# EAGLE design BB-PCF (EAGLE 6.3)
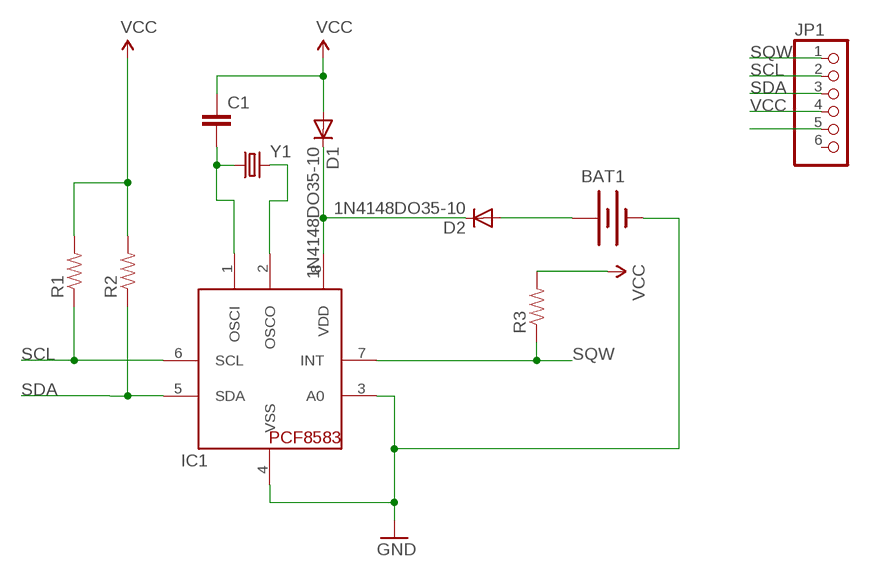
[diagram p0: schematic, sheet 1]

## Parts
BAT1  BATTERY20PTH  [BATTCOM_20MM_PTH]
C1  CAPPTH  [CAP-PTH-SMALL]
D1  1N4148DO35-10  [DO35-10]
D2  1N4148DO35-10  [DO35-10]
IC1  PCF8583  [DIL08]
JP1  PINHD-1X6  [1X06]
R1  RESISTORPTH-1/4W  [AXIAL-0.4]
R2  RESISTORPTH-1/4W  [AXIAL-0.4]
R3  RESISTORPTH-1/4W  [AXIAL-0.4]
Y1  CRYSTALTC26H_EZ  [TC26HEZ]

## Nets
GND: BAT1.2(-) IC1.3(A0) IC1.4(VSS) JP1.5
N$1: D1.C D2.C IC1.8(VDD)
N$2: BAT1.1(+) D2.A
N$5: C1.2 IC1.1(OSCI) Y1.1
N$6: IC1.2(OSCO) Y1.2
SCL: IC1.6(SCL) JP1.2 R1.P$1
SDA: IC1.5(SDA) JP1.3 R2.P$1
SQW: IC1.7(INT) JP1.1 R3.P$1
VCC: C1.1 D1.A JP1.4 R1.P$2 R2.P$2 R3.P$2
Unconnected: JP1.6

## Library data of the parts
BAT1 = SparkFun-Electromechanical:BATTERY: Battery Holders Various common sizes : AA, AAA, 20mm coin cell and 12mm coin cell.
C1 = SparkFun-Capacitors:CAP: Capacitor Standard 0603 ceramic capacitor, and 0.1" leaded capacitor.
D1 D2 = diode:1N4148: DIODE high speed (Philips)
IC1 = RTC:PCF8583: PCF8583 Real time clock (RTC) with battery backup ability. Talk to it via i2c
JP1 = adafruit:PINHD-1X6: PIN HEADER
R1-R3 = SparkFun-Resistors:RESISTOR: Resistor Basic schematic elements and footprints for 0603, 1206, and PTH resistors.
Y1 = SparkFun-FreqCtrl:CRYSTAL: Various standard crystals. Proven footprints. Spark Fun Electronics SKU : COM-00534

## Board
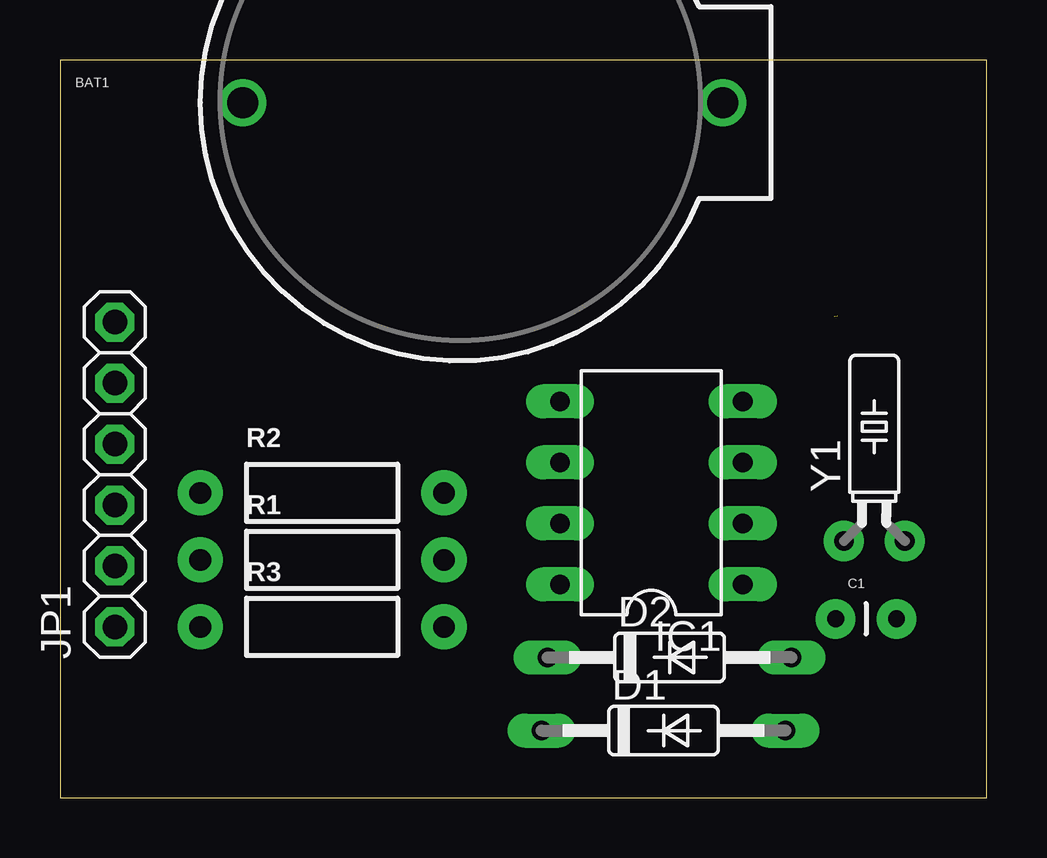
[diagram p1: board, top side]
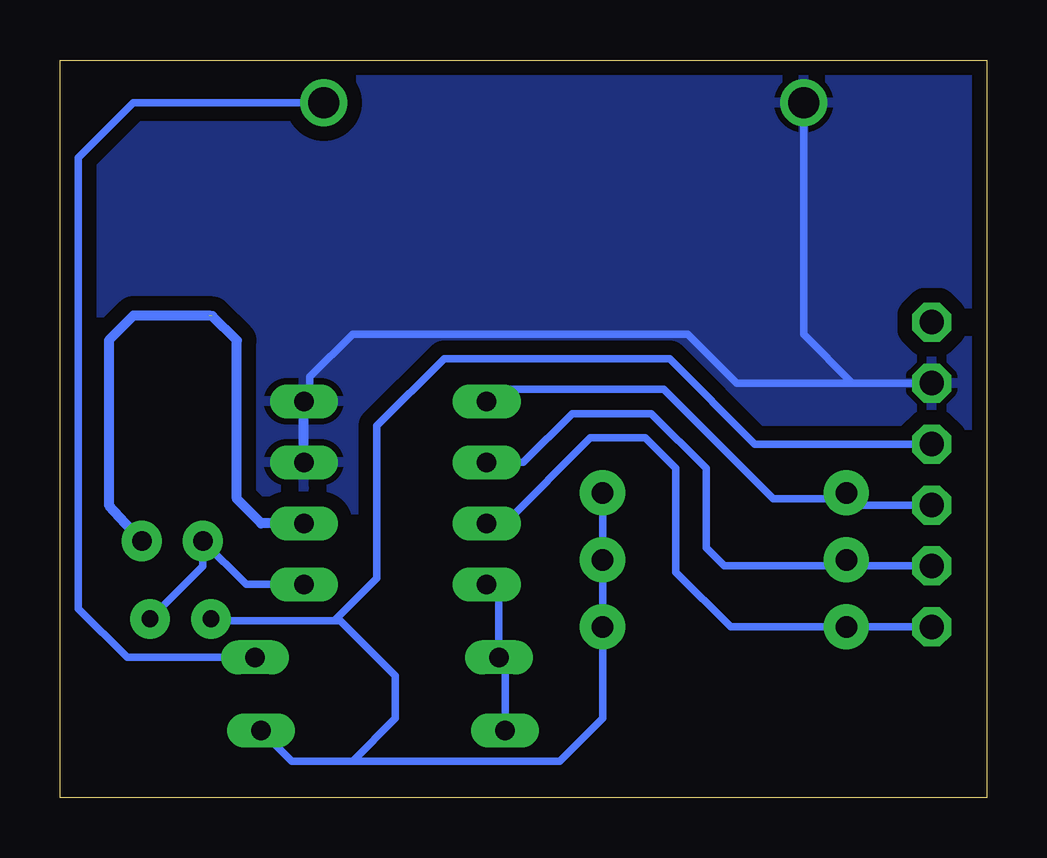
[diagram p2: board, bottom side, seen from below]

Size 38.61 x 30.73 mm. Coordinates in mm from the lower left corner, seen from the top.
Outline: 0,0 38.61,0 38.61,30.73 0,30.73 0,0
Copper layers (1*16): Top 0.035mm / dielectric 1.5mm / Bottom 0.035mm
Design rules "SparkFun": minimum track width 8mil, minimum drill 20mil, track to track 8mil, track to pad 8mil, pad to pad 8mil, via to via 8mil, smd to smd 8mil, copper to edge 10mil, drill to drill 8mil, minimum pad ring 12mil, minimum via ring 10mil, stop-mask expansion 4mil, vias tented up to drill 25mil, thermal gap 10mil

### Footprints (pad centres in the part's own frame; a part is rotated, then mirrored left to right if it is on the bottom)
BATTCOM_20MM_PTH = drill 1.3: 1 20,0; 2 0,0
CAP-PTH-SMALL = drill 0.7 pad 1.651: 1 0,0; 2 2.54,0
DO35-10 = drill 0.813 long: A 5.08,0; C -5.08,0
DIL08 = drill 0.813 long: 1 -3.81,-3.81; 2 -1.27,-3.81; 3 1.27,-3.81; 4 3.81,-3.81; 5 3.81,3.81; 6 1.27,3.81; 7 -1.27,3.81; 8 -3.81,3.81
1X06 = drill 1.016 octagon: 1 -6.35,0; 2 -3.81,0; 3 -1.27,0; 4 1.27,0; 5 3.81,0; 6 6.35,0
AXIAL-0.4 = drill 0.9 pad 1.88: P$1 -5.08,0; P$2 5.08,0
TC26HEZ = drill 0.813 pad 1.676: 1 -1.27,0; 2 1.27,0

### Placement (x,y rotation side)
BAT1  7.62,28.96 0 top
C1  32.32,7.45 0 top
D1  25.15,2.79 0 top
D2  25.4,5.84 0 top
IC1  24.64,12.7 90 top
JP1  2.29,13.46 90 top
R1  10.92,9.91 0 top
R2  10.92,12.7 0 top
R3  10.92,7.11 0 top
Y1  33.93,10.69 0 top

### Tracks (layer width: path | path; a pad name or v marks a point on that pad's centre or on a via)
GND
  Bottom 0.305: JP1.5 5.59,17.27 | 5.59,17.27 10.41,17.27 12.45,19.3 26.42,19.3 28.19,17.53 28.19,16.76 IC1.4 | BAT1.2 7.62,19.3 5.59,17.27
  Bottom 0.406: IC1.3 IC1.4
  pour Bottom (isolate 0.61): 0.51,29.72 0.51,0.51 38.1,0.51 38.1,29.97 0.51,29.97
N$1
  Bottom 0.305: D1.C 20.07,5.59 D2.C 20.32,8.38 IC1.8
N$2
  Bottom 0.305: D2.A 35.81,5.84 37.85,7.87 37.85,26.67 35.56,28.96 BAT1.1
N$5
  Bottom 0.305: IC1.1 30.86,8.89 Y1.1 32.66,9.65 C1.2
  Bottom 0.406: Y1.1 32.68,10.69
N$6  (1 unrouted)
  Bottom 0.406: IC1.2 30.23,11.43 31.24,12.45 31.24,19.05 32.26,20.07 | Y1.2 36.58,12.19 36.58,19.05 35.55,20.08 32.39,20.08
SCL
  Bottom 0.305: IC1.6 19.3,13.97 17.27,16 13.97,16 11.68,13.72 11.68,10.41 10.92,9.65 6.1,9.65 R1.P$1 5.59,9.65 JP1.2
SDA
  Bottom 0.305: JP1.3 5.33,12.19 R2.P$1 6.1,12.45 8.89,12.45 13.46,17.02 20.32,17.02 IC1.5
SQW
  Bottom 0.305: IC1.7 20.07,11.43 16.51,14.99 14.22,14.99 12.95,13.72 12.95,9.4 10.67,7.11 R3.P$1 JP1.1
VCC
  Bottom 0.305: R2.P$2 R1.P$2 R3.P$2 16,3.3 17.78,1.52 26.42,1.52 | D1.A 28.96,1.52 26.42,1.52 | JP1.4 9.65,14.73 13.21,18.29 22.61,18.29 25.4,15.49 25.4,9.14 27.18,7.37 | 27.18,7.37 32.23,7.37 C1.1 | 27.18,7.37 26.92,7.37 24.64,5.08 24.64,3.3 26.42,1.52